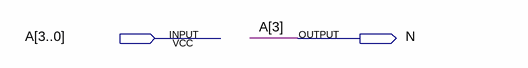
[diagram p0: schematic sheet]
// Quartus schematic negative.bdf as structural Verilog: 0 symbols, 2 pins
module negative (
  input  [3:0] A,
  output N
);


  assign N = A[3];
endmodule
